# Altium project water level.PrjPCB
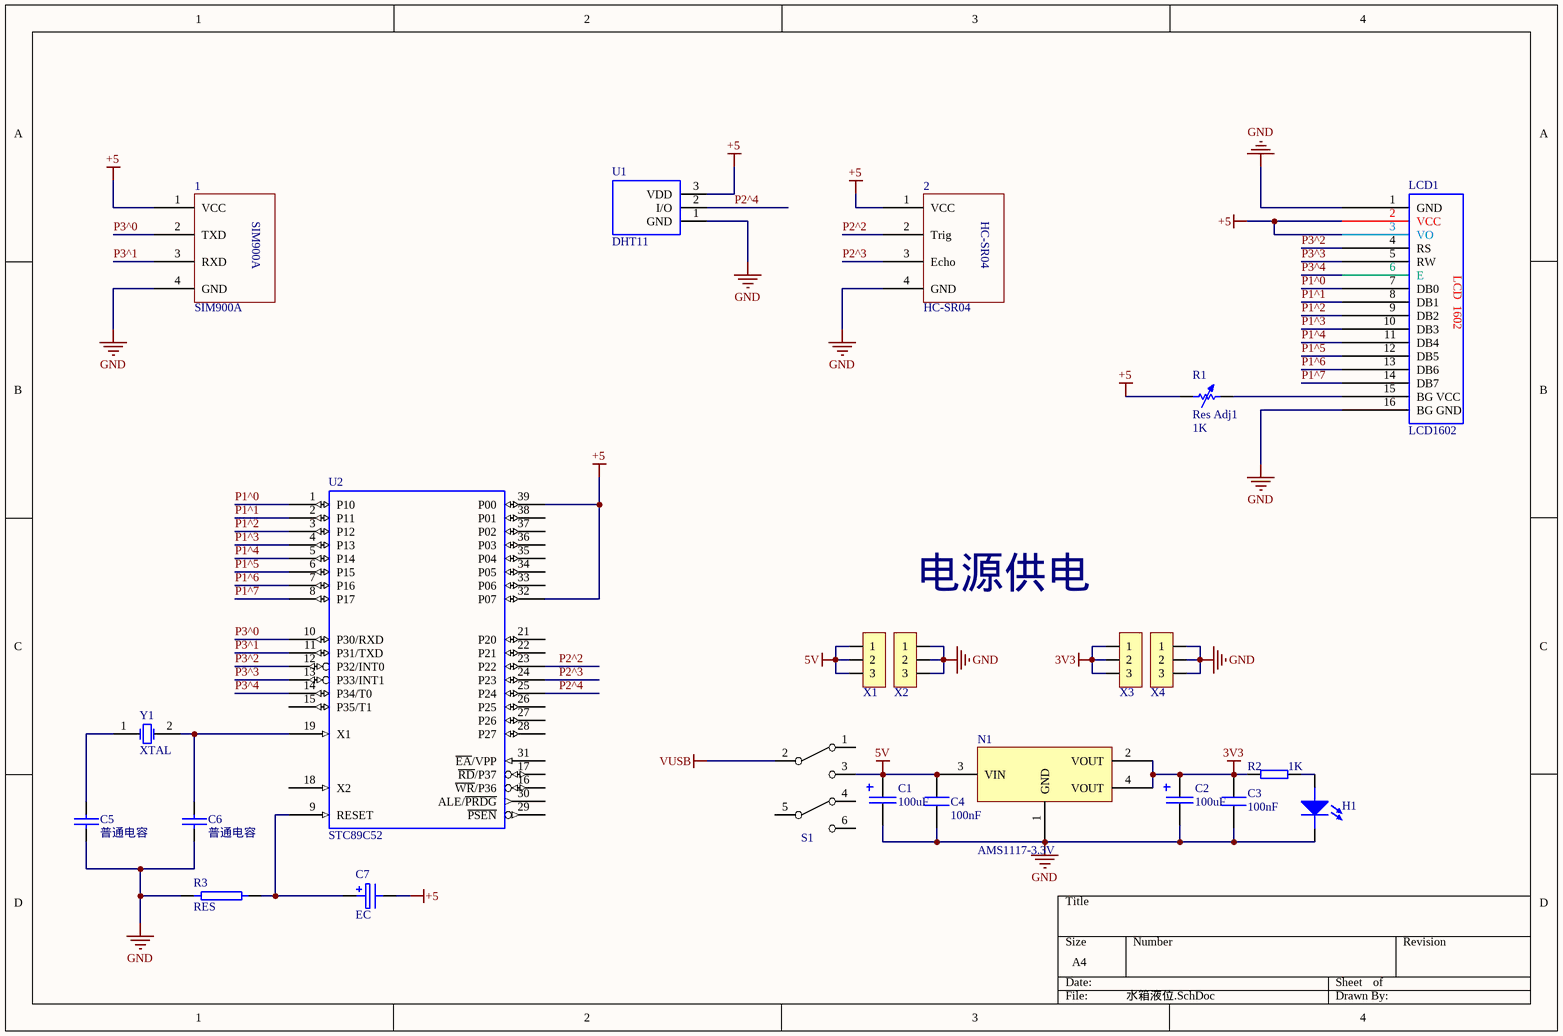
[diagram p0: 水箱液位.SchDoc]
1 sheet, 23 parts. Net scope: global (net labels, ports and power ports of the same name join across sheets).

## Sheet 水箱液位.SchDoc
size A4

### Parts
1  SIM900A
2  HC-SR04
C1  100uF  [CAP5*5_4]
C2  100uF  [CAP5*5_4]
C3  100nF  [C0805]
C4  100nF  [C0805]
C5  普通电容  [RAD0.1]
C6  普通电容  [RAD0.1]
C7  EC  [RB.1/.2]
H1  发光二极管  [LED1206]  (value not drawn)
LCD1  LCD1602  [1602LCD]
N1  AMS1117-3.3V  [SOT223]
R1  Res Adj1  value 1K  [AXIAL-0.7]
R2  1K  [R0805]
R3  RES  [AXIAL0.4]
S1  SWITCH-6  [SW-AJ]  (value not drawn)
U1  DHT11  [TO-92A]
U2  STC89C52  [DIP-40]
X1  JX3  [SIP3]  (value not drawn)
X2  JX3  [SIP3]  (value not drawn)
X3  JX3  [SIP3]  (value not drawn)
X4  JX3  [SIP3]  (value not drawn)
Y1  XTAL  [R38]

### Nets
3V3: C2.1 C3.1 N1.2(VOUT) N1.4(VOUT) R2.1 X3.1 X3.2 X3.3
5V: C1.1 C4.1 N1.3(VIN) S1.3 X1.1 X1.2 X1.3
+5: 1.1(VCC) 2.1(VCC) C7.2(E) LCD1.2(VCC) LCD1.3(VO) R1.1 U1.3(VDD) U2.32(P07) U2.39(P00)
GND: 1.4(GND) 2.4(GND) C1.2 C2.2 C3.2 C4.2 C5.1 C6.1 H1.2(K) LCD1.1(GND) LCD1.16(BG_GND) N1.1(GND) R3.1 U1.1(GND) U2.20(GND) X2.1 X2.2 X2.3 X4.1 X4.2 X4.3
VCC: U2.40(VCC)
VUSB: S1.2
\: LCD1.8(DB1) U2.2(P11)  [also labelled P1^1]
P1^0: LCD1.7(DB0) U2.1(P10)
P1^2: LCD1.9(DB2) U2.3(P12)
P1^3: LCD1.10(DB3) U2.4(P13)
P1^4: LCD1.11(DB4) U2.5(P14)
P1^5: LCD1.12(DB5) U2.6(P15)
P1^6: LCD1.13(DB6) U2.7(P16)
P1^7: LCD1.14(DB7) U2.8(P17)
P2^2: 2.2(Trig) U2.23(P22)
P2^3: 2.3(Echo) U2.24(P23)
P2^4: U1.2(I/O) U2.25(P24)
P3^0: 1.2(TXD) U2.10(P30/RXD)
P3^1: 1.3(RXD) U2.11(P31/TXD)
P3^2: LCD1.4(RS) U2.12(P32/INT0)
P3^3: LCD1.5(RW) U2.13(P33/INT1)
P3^4: LCD1.6(E) U2.14(P34/T0)
NetC5_2: C5.2 Y1.1(OSC1)
NetC6_2: C6.2 U2.19(X1) Y1.2(OSC2)
NetC7_1: C7.1 R3.2 U2.9(RESET)
NetH1_1: H1.1(A) R2.2
NetLCD1_15: LCD1.15(BG_VCC) R1.2

Not connected (* = marked no-connect by the designer): S1 1 4 5 6; U2 15(P35/T1) 16(~{WR}/P36) 17(~{RD}/P37) 18(X2) 21(P20) 22(P21) 26(P25) 27(P26) 28(P27) 29(~{PSEN}) 30(ALE/~{PRDG}) 31(~{EA}/VPP) 33(P06) 34(P05) 35(P04) 36(P03) 37(P02) 38(P01)

### Notes on the sheet
- 电源供电
- (in symbol LCD1602) LCD  1602

### Library data of the parts
1 2 = Component_1
C1 C2 = 极性电容器: TD_Model: *
C3 C4 = 普通贴片电容: Capacitor
C5 C6 = 普通电容: Capacitor
R1 = Res Adj1: Variable Resistor; Set Position: 0.5; Published: 8-Jun-2000; LatestRevisionDate: 17-Jul-2002; LatestRevisionNote: Re-released for DXP Platform.; PackageReference: AXIAL-0.7; Publisher: Altium Limited; PackageDescription: Axial Device, Thru-Hole; 2 Leads; 0.7 in Pin Spacing
R2 = 普通贴片电阻
U1 = DS18B20
U2 = AT89C51
X1-X4 = JX3: Connector
Y1 = XTAL: Crystal Oscillator; Published: 8-Jun-2000; LatestRevisionDate: 17-Jul-2002; LatestRevisionNote: Re-released for DXP Platform.; PackageReference: R38; Publisher: Altium Limited; PackageDescription: Crystal, Thru-Hole; 2 Leads; Body 3.1 x 8.2 mm (Dia.xH)